# EAGLE design Nodino-Cortex-Debug (EAGLE 6.5.0)
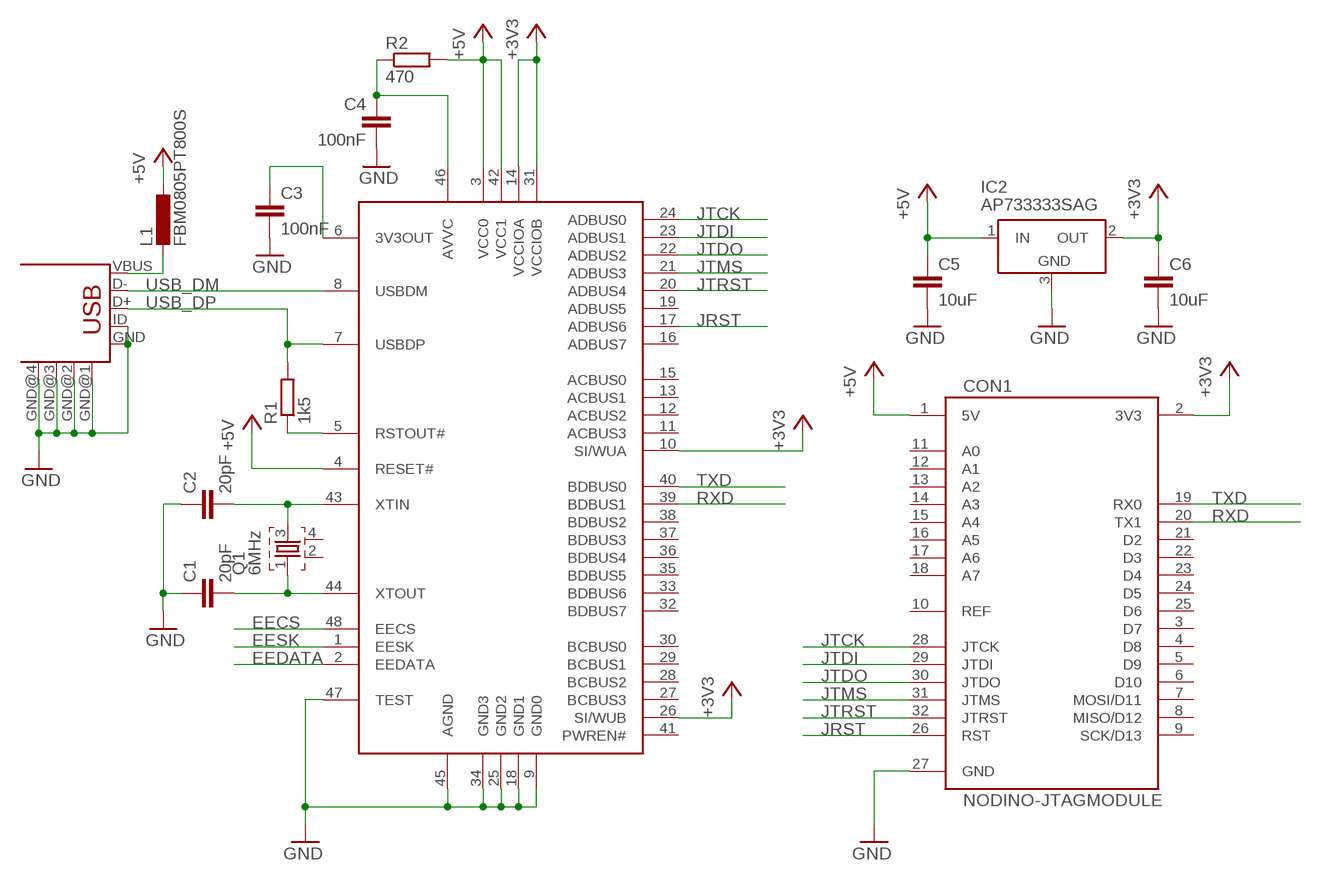
[diagram p0: schematic, sheet 1]

## Parts
C1  20pF  C-EUC0603K  [C0603K]
C2  20pF  C-EUC0603K  [C0603K]
C3  100nF  C-EUC0603K  [C0603K]
C4  100nF  C-EUC0603K  [C0603K]
C5  10uF  C-EUC0603K  [C0603K]
C6  10uF  C-EUC0603K  [C0603K]
CON1  NODINO-JTAGMODULE  [NODINO-JTAG-MOD]
CON2  USB-OTG_SHIELD  [USB-UAB-S1]
IC1  FT2232D  FT2232C  [LQFP48]
IC2  AP733333SAG  [SOT23]
L1  FBM0805PT800S  L-EUL0805  [L0805]
Q1  6MHz  FA-20H  [FA-20H]
R1  1k5  R-EU_R0603K  [R0603K]
R2  470  R-EU_R0603K  [R0603K]

## Nets
+3V3: C6.1 CON1.2(3V3) IC1.10(SI/WUA) IC1.14(VCCIOA) IC1.26(SI/WUB) IC1.31(VCCIOB) IC2.2(OUT)
+5V: C5.1 CON1.1(5V) IC1.3(VCC0) IC1.4(RESET#) IC1.42(VCC1) IC2.1(IN) L1.1 R2.2
EECS: IC1.48(EECS)
EEDATA: IC1.2(EEDATA)
EESK: IC1.1(EESK)
GND: C1.1 C2.1 C3.2 C4.2 C5.2 C6.2 CON1.27(GND) CON2.GND CON2.GND@1(GND) CON2.GND@2(GND) CON2.GND@3(GND) CON2.GND@4(GND) CON2.ID IC1.9(GND0) IC1.18(GND1) IC1.25(GND2) IC1.34(GND3) IC1.45(AGND) IC1.47(TEST) IC2.3(GND)
JRST: CON1.26(RST) IC1.17(ADBUS6)
JTCK: CON1.28(JTCK) IC1.24(ADBUS0)
JTDI: CON1.29(JTDI) IC1.23(ADBUS1)
JTDO: CON1.30(JTDO) IC1.22(ADBUS2)
JTMS: CON1.31(JTMS) IC1.21(ADBUS3)
JTRST: CON1.32(JTRST) IC1.20(ADBUS4)
N$1: CON2.VBUS L1.2
N$13: IC1.5(RSTOUT#) R1.1
N$14: C4.1 IC1.46(AVVC) R2.1
N$15: C3.1 IC1.6(3V3OUT)
N$16: C1.2 IC1.44(XTOUT) Q1.1
N$17: C2.2 IC1.43(XTIN) Q1.3
RXD: CON1.20(TX1) IC1.39(BDBUS1)
TXD: CON1.19(RX0) IC1.40(BDBUS0)
USB_DM: CON2.D- IC1.8(USBDM)
USB_DP: CON2.D+ IC1.7(USBDP) R1.2
Unconnected: CON1.3(D7) CON1.4(D8) CON1.5(D9) CON1.6(D10) CON1.7(MOSI/D11) CON1.8(MISO/D12) CON1.9(SCK/D13) CON1.10(REF) CON1.11(A0) CON1.12(A1) CON1.13(A2) CON1.14(A3) CON1.15(A4) CON1.16(A5) CON1.17(A6) CON1.18(A7) CON1.21(D2) CON1.22(D3) CON1.23(D4) CON1.24(D5) CON1.25(D6) IC1.11(ACBUS3) IC1.12(ACBUS2) IC1.13(ACBUS1) IC1.15(ACBUS0) IC1.16(ADBUS7) IC1.19(ADBUS5) IC1.27(BCBUS3) IC1.28(BCBUS2) IC1.29(BCBUS1) IC1.30(BCBUS0) IC1.32(BDBUS7) IC1.33(BDBUS6) IC1.35(BDBUS5) IC1.36(BDBUS4) IC1.37(BDBUS3) IC1.38(BDBUS2) IC1.41(PWREN#) Q1.2 Q1.4

## Library data of the parts
C1-C6 = resistor:C-EU: CAPACITOR, European symbol
CON1 = nodino:NODINO-JTAG
CON2 = con-usb-2:USB-OTG_SHIELD
IC1 = ftdichip-3:FT2232C: USB UART / FIFO Controller 3nd Generation USB Double-UART (USB <-> Serial) - FIFO Controller
IC2 = diodes_inc:AP7333
L1 = resistor:L-EU: INDUCTOR, European symbol
Q1 = crystal:FA-: MHz RANGE CRYSTAL UNIT Source: Epson Toyocom
R1 R2 = resistor:R-EU_: RESISTOR, European symbol

## Board
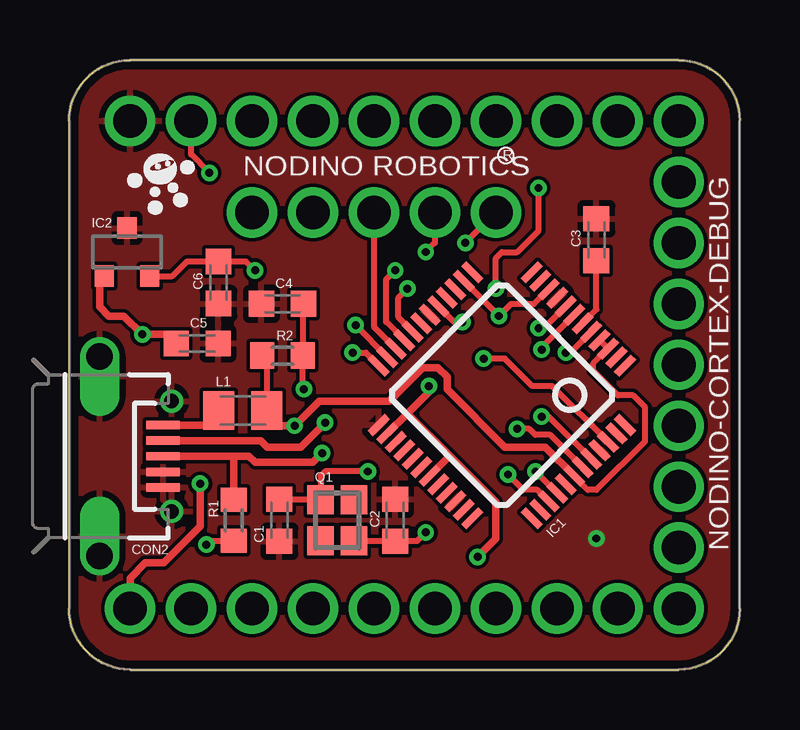
[diagram p1: board, top side]
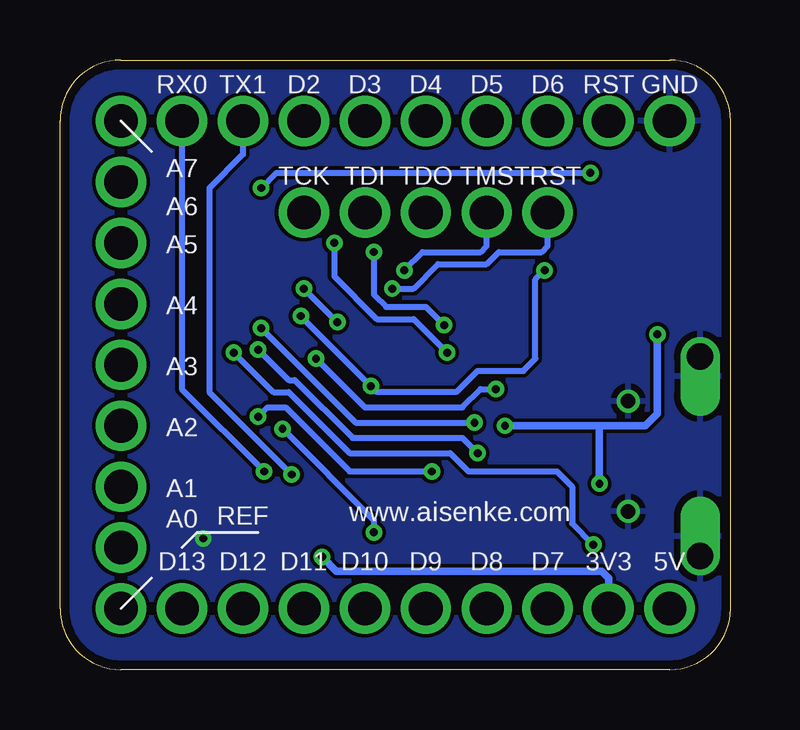
[diagram p2: board, bottom side, seen from below]

Size 27.94 x 25.4 mm. Coordinates in mm from the lower left corner, seen from the top.
Outline: 0,2.54 0,22.86 arc-90 2.54,25.4 25.4,25.4 arc-90 27.94,22.86 27.94,2.54 arc-90 25.4,0 2.54,0 arc-90 0,2.54
Copper layers (1*16): Top 0.0356mm / dielectric 1.5011mm / Bottom 0.0356mm
Design rules "LaenPCBOrder": minimum track width 6mil, minimum drill 13mil, track to track 6mil, track to pad 6mil, pad to pad 6mil, via to via 6mil, smd to smd 6mil, copper to edge 15mil, drill to drill 6mil, minimum pad ring 7mil, minimum via ring 7mil, stop-mask expansion 3mil, vias tented up to drill 0mil, thermal gap 10mil

### Footprints (pad centres in the part's own frame; a part is rotated, then mirrored left to right if it is on the bottom)
C0603K = smd 1.05 x 1.08: 1 -0.875,0; 2 0.875,0
NODINO-JTAG-MOD = drill 1.4 pad 2.1: 1 -11.43,-10.16; 2 -8.89,-10.16; 3 -6.35,-10.16; 4 -3.81,-10.16; 5 -1.27,-10.16; 6 1.27,-10.16; 7 3.81,-10.16; 8 6.35,-10.16; 9 8.89,-10.16; 10 11.43,-10.16; 11 11.43,-7.62; 12 11.43,-5.08; 13 11.43,-2.54; 14 11.43,0; 15 11.43,2.54; 16 11.43,5.08; 17 11.43,7.62; 18 11.43,10.16; 19 8.89,10.16; 20 6.35,10.16; 21 3.81,10.16; 22 1.27,10.16; 23 -1.27,10.16; 24 -3.81,10.16; 25 -6.35,10.16; 26 -8.89,10.16; 27 -11.43,10.16; 28 3.81,6.35; 29 1.27,6.35; 30 -1.27,6.35; 31 -3.81,6.35; 32 -6.35,6.35
USB-UAB-S1 = smd 0.35 x 1.4: D+ 0,2.65; D- -0.65,2.65; GND 1.3,2.65; ID 0.65,2.65; VBUS -1.3,2.65 | drill 0.6: GND@1 -2.3,3; GND@2 2.3,3 | drill 1.1 offset: GND@3 -4.15,0; GND@4 4.15,0
LQFP48 = smd 0.3 x 1: 1 -2.75,-4.5; 2 -2.25,-4.5; 3 -1.75,-4.5; 4 -1.25,-4.5; 5 -0.75,-4.5; 6 -0.25,-4.5; 7 0.25,-4.5; 8 0.75,-4.5; 9 1.25,-4.5; 10 1.75,-4.5; 11 2.25,-4.5; 12 2.75,-4.5; 25 2.75,4.5; 26 2.25,4.5; 27 1.75,4.5; 28 1.25,4.5; 29 0.75,4.5; 30 0.25,4.5; 31 -0.25,4.5; 32 -0.75,4.5; 33 -1.25,4.5; 34 -1.75,4.5; 35 -2.25,4.5; 36 -2.75,4.5 | smd 1 x 0.3: 13 4.5,-2.75; 14 4.5,-2.25; 15 4.5,-1.75; 16 4.5,-1.25; 17 4.5,-0.75; 18 4.5,-0.25; 19 4.5,0.25; 20 4.5,0.75; 21 4.5,1.25; 22 4.5,1.75; 23 4.5,2.25; 24 4.5,2.75; 37 -4.5,2.75; 38 -4.5,2.25; 39 -4.5,1.75; 40 -4.5,1.25; 41 -4.5,0.75; 42 -4.5,0.25; 43 -4.5,-0.25; 44 -4.5,-0.75; 45 -4.5,-1.25; 46 -4.5,-1.75; 47 -4.5,-2.25; 48 -4.5,-2.75
SOT23 = smd 0.8 x 0.9: 1 -0.95,-1; 2 0.95,-1; 3 0,1
L0805 = smd 1.3 x 1.6: 1 -1,0; 2 1,0
FA-20H = smd 1.2 x 1.1: 1 -0.85,-0.7; 2 0.85,-0.7; 3 0.85,0.7; 4 -0.85,0.7
R0603K = smd 1 x 1.1: 1 -0.85,0; 2 0.85,0

### Placement (x,y rotation side)
C1  8.76,6.22 90 top
C2  13.59,6.22 270 top
C3  21.97,17.91 90 top
C4  8.89,15.24 180 top
C5  5.33,13.59 0 top
C6  6.22,16.13 270 top
CON1  13.97,12.7 0 top
CON2  1.27,8.89 270 top
IC1  18.03,11.43 135 top
IC2  2.41,17.4 0 top
L1  7.24,10.79 180 top
Q1  11.18,6.22 270 top
R1  6.86,6.22 90 top
R2  8.89,13.08 180 top

### Tracks (layer width: path | path; a pad name or v marks a point on that pad's centre or on a via)
+3V3  (via drill 0.33)
  Top 0.254: 3.3,16.34 IC2.2 4.3,16.4 4.91,17 C6.1 7.38,17 v7.75,16.64 | IC1.10 19.37,15.24 18.41,15.24 v17.91,14.73 17.78,14.87 IC1.14 | 15.85,8.89 15.88,8.89 | 14.09,10.67 14.1,10.67
  Top 0.305: v17.02,4.7 17.78,5.46 17.78,6.99 15.88,8.89 14.1,10.67 14.99,11.56 v14.99,11.81 | IC1.31 15.85,8.89 | IC1.26 14.09,10.67
  Bottom 0.254: v17.91,14.73 v14.99,11.81 14.73,11.56 11.43,11.56 10.54,12.45 8.64,12.45 8.13,12.95 8.13,16.26 v7.75,16.64
  Bottom 0.305: CON1.2 5.08,3.81 5.37,4.1 16.42,4.1 v17.02,4.7
+5V  (via drill 0.33)
  Top 0.254: 8.75,10.16 L1.1 8.24,12.93 R2.2 | 1.27,16.21 IC2.1 | IC1.42 21.62,7.49 21.97,7.49 24,9.53 24,10.92 23.5,11.43 22.86,11.43 21.84,12.45 21.84,12.77 IC1.3 IC1.4 | IC1.4
  Top 0.305: CON1.1 2.54,3.81 3.17,4.45 3.94,4.45 5.46,5.97 v5.46,7.75 | 8.75,10.16 v9.4,10.16 10.41,11.18 13.34,11.18 14.73,12.57 15.37,12.57 15.75,12.19 15.75,11.68 18.16,9.27 19.84,9.27 IC1.42 | 1.27,16.21 1.27,15.11 1.65,14.73 2.29,14.73 v3.05,13.97 4.08,13.97 C5.1
  Bottom 0.305: v5.46,7.75 5.46,10.16 | 5.46,10.16 v9.4,10.16 | 5.46,10.16 3.56,10.16 3.05,10.67 v3.05,13.97
GND  (via drill 0.33)
  other vias: 21.97,5.46
  pour Top: 0,25.4 27.94,25.4 27.94,0 0,0
  pour Bottom: 0,25.4 27.94,25.4 27.94,0 0,0
JRST  (via drill 0.33)
  Top 0.254: IC1.17 16.05,14.48 v16.38,14.48 | v17.78,15.88 17.78,17.14 18.03,17.4 18.67,17.4 19.56,18.29 v19.56,20.07 | v5.84,20.7 5.08,21.46 CON1.26
  Bottom 0.254: v16.38,14.48 v17.78,15.88 | v19.56,20.07 18.92,20.7 v5.84,20.7
JTCK  (via drill 0.33)
  Top 0.254: CON1.28 v16.51,17.78 | v11.81,13.21 12.37,13.21 IC1.24
  Bottom 0.254: v16.51,17.78 16.51,16.38 14.73,14.61 13.21,14.61 v11.81,13.21
JTDI  (via drill 0.33)
  Top 0.254: CON1.29 15.24,17.78 v14.86,17.4 | v11.94,14.35 v11.94,14.34 IC1.23
  Bottom 0.254: v14.86,17.4 14.86,15.62 14.35,15.11 12.7,15.11 v11.94,14.35
JTDO
  Top 0.254: CON1.30 12.7,14.29 IC1.22
JTMS  (via drill 0.33)
  Top 0.254: IC1.21 13.21,14.49 13.21,16.26 v13.59,16.64
  Bottom 0.254: v13.59,16.64 12.83,17.4 10.41,17.4 10.16,17.65 CON1.31
JTRST  (via drill 0.33)
  Top 0.254: IC1.20 13.72,14.69 13.72,15.49 v14.1,15.88
  Bottom 0.254: v14.1,15.88 13.21,15.88 12.19,16.89 10.16,16.89 9.65,17.4 7.87,17.4 7.62,17.65 CON1.32
N$1
  Top 0.254: 5.63,10.19 L1.2
  Top 0.305: CON2.VBUS 5.63,10.19
N$13  (via drill 0.33)
  Top 0.254: IC1.5 20.87,13.21 v20.7,13.21 | v5.71,5.21 5.88,5.37 R1.1
  Bottom 0.254: v20.7,13.21 19.05,11.56 18.41,11.56 15.88,9.02 11.68,9.02 10.92,8.26 7.24,8.26 6.6,7.62 6.6,6.1 v5.71,5.21
N$14  (via drill 0.33)
  Top 0.254: IC1.46 20.13,11.81 19.3,11.81 18.16,12.95 v17.27,12.95 | C4.1 9.74,15.21 R2.1 9.74,11.72 v9.78,11.68
  Bottom 0.254: v17.27,12.95 15.24,10.92 11.18,10.92 10.41,11.68 v9.78,11.68
N$15
  Top 0.254: IC1.6 21.97,15.01 C3.1
N$16  (via drill 0.33)
  Top 0.254: C1.2 10.22,7.1 Q1.1 10.48,8.06 10.67,8.26 v12.45,8.26 | IC1.44 19.98,10.54 v19.68,10.54
  Bottom 0.254: v19.68,10.54 19.3,10.92 18.54,10.92 15.88,8.26 v12.45,8.26
N$17  (via drill 0.33)
  Top 0.254: Q1.3 11.62,5.35 C2.2 14.49,5.35 v14.86,5.71 | IC1.43 20.04,9.78 19.43,9.78 19.18,10.03 v18.67,10.03
  Bottom 0.254: v18.67,10.03 14.86,6.22 v14.86,5.71
RXD  (via drill 0.33)
  Top 0.254: IC1.39 19.5,7.49 18.92,7.49 v18.29,8.13
  Bottom 0.254: CON1.20 20.32,21.46 21.72,20.07 21.72,11.56 v18.29,8.13
TXD  (via drill 0.33)
  Top 0.254: v19.43,8.26 IC1.40
  Bottom 0.254: CON1.19 22.86,11.68 v19.43,8.26
USB_DM  (via drill 0.33)
  Top 0.254: IC1.8 19.77,14.22 v19.56,14.22
  Top 0.305: CON2.D- 7.99,9.54 8.26,9.27 9.65,9.27 v10.67,10.29
  Bottom 0.254: v19.56,14.22 15.62,10.29 v10.67,10.29
USB_DP  (via drill 0.33)
  Top 0.254: v19.68,13.34 19.71,13.46 IC1.7
  Top 0.305: CON2.D+ 6.86,8.89 | 6.86,8.89 R1.2 | 6.86,8.89 7.49,8.89 7.75,8.64 10.16,8.64 v10.54,9.02
  Bottom 0.254: v19.68,13.34 18.41,12.06 18.16,12.06 15.75,9.65 11.18,9.65 v10.54,9.02

### Text on the board
tPlace: NODINO ROBOTICS | R | NODINO-CORTEX-DEBUG
bPlace: www.aisenke.com